# EAGLE design driver (EAGLE 5.02)
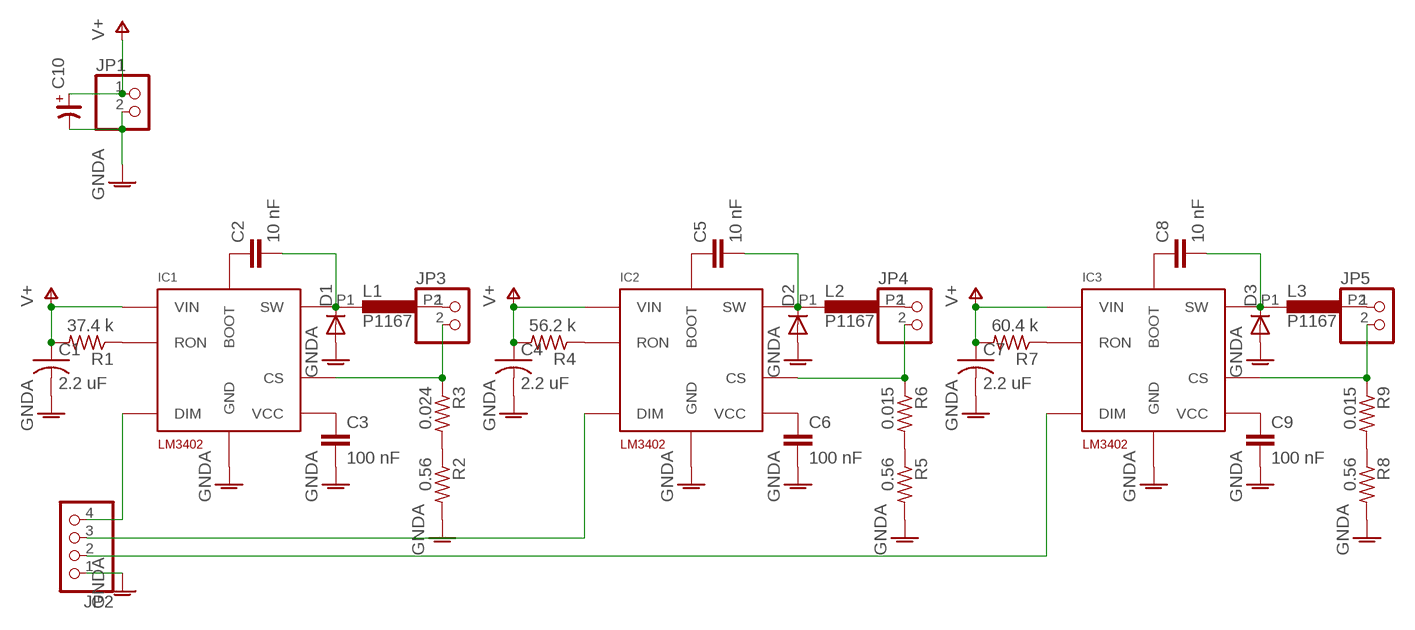
[diagram p0: schematic, sheet 1]

## Parts
C1  2.2 uF  C-USC1206  [C1206]
C2  10 nF  C-EUC0402  [C0402]
C3  100 nF  C-EUC0603  [C0603]
C4  2.2 uF  C-USC1206  [C1206]
C5  10 nF  C-EUC0402  [C0402]
C6  100 nF  C-EUC0603  [C0603]
C7  2.2 uF  C-USC1206  [C1206]
C8  10 nF  C-EUC0402  [C0402]
C9  100 nF  C-EUC0603  [C0603]
C10  CP_SV-D  [CSV-D]
D1  DIODE-SOD123  [SOD123]
D2  DIODE-SOD123  [SOD123]
D3  DIODE-SOD123  [SOD123]
IC1  LM3402  [8-PSOP]
IC2  LM3402  [8-PSOP]
IC3  LM3402  [8-PSOP]
JP1  PINHD-1X2  [1X02]
JP2  PINHD-1X4  [1X04]
JP3  PINHD-1X2  [1X02]
JP4  PINHD-1X2  [1X02]
JP5  PINHD-1X2  [1X02]
L1  P1167  [P1167]
L2  P1167  [P1167]
L3  P1167  [P1167]
R1  37.4 k  R-US_R0805  [R0805]
R2  0.56  R-US_R0805  [R0805]
R3  0.024  R-US_R1206  [R1206]
R4  56.2 k  R-US_R0805  [R0805]
R5  0.56  R-US_R0805  [R0805]
R6  0.015  R-US_R2010  [R2010]
R7  60.4 k  R-US_R0805  [R0805]
R8  0.56  R-US_R0805  [R0805]
R9  0.015  R-US_R2010  [R2010]

## Nets
GNDA: C1.2 C3.2 C4.2 C6.2 C7.2 C9.2 C10.- D1.A D2.A D3.A IC1.P4(GND) IC2.P4(GND) IC3.P4(GND) JP1.2 JP2.1 R2.2 R5.2 R8.2
N$1: C2.1 IC1.P2(BOOT)
N$2: C3.1 IC1.P7(VCC)
N$3: IC1.P3(DIM) JP2.4
N$4: C2.2 D1.C IC1.P1(SW) L1.P1
N$5: IC1.P6(RON) R1.1
N$6: IC1.P5(CS) JP3.2 R3.1
N$7: R2.1 R3.2
N$8: JP3.1 L1.P2
N$9: IC2.P3(DIM) JP2.3
N$10: IC3.P3(DIM) JP2.2
N$11: IC2.P6(RON) R4.1
N$12: R5.1 R6.2
N$13: C5.1 IC2.P2(BOOT)
N$14: C5.2 D2.C IC2.P1(SW) L2.P1
N$15: C6.1 IC2.P7(VCC)
N$16: JP4.1 L2.P2
N$17: IC2.P5(CS) JP4.2 R6.1
N$18: IC3.P6(RON) R7.1
N$19: JP5.1 L3.P2
N$20: C8.1 IC3.P2(BOOT)
N$21: C9.1 IC3.P7(VCC)
N$22: R8.1 R9.2
N$23: C8.2 D3.C IC3.P1(SW) L3.P1
N$25: IC3.P5(CS) JP5.2 R9.1
V+: C1.1 C4.1 C7.1 C10.+ IC1.P8(VIN) IC2.P8(VIN) IC3.P8(VIN) JP1.1 R1.2 R4.2 R7.2

## Library data of the parts
C1 C4 C7 = rcl:C-US: CAPACITOR, American symbol
C2 C3 C5 C6 C8 C9 = rcl:C-EU: CAPACITOR, European symbol
C10 = rc-master-smd:CP_: POLARIZED CAP
D1-D3 = diode:DIODE-: DIODE
IC1-IC3 = indaylight:LM3402
JP1 JP3-JP5 = pinhead:PINHD-1X2: PIN HEADER
JP2 = pinhead:PINHD-1X4: PIN HEADER
L1-L3 = indaylight:P1167
R1-R9 = rcl:R-US_: RESISTOR, American symbol

## Board
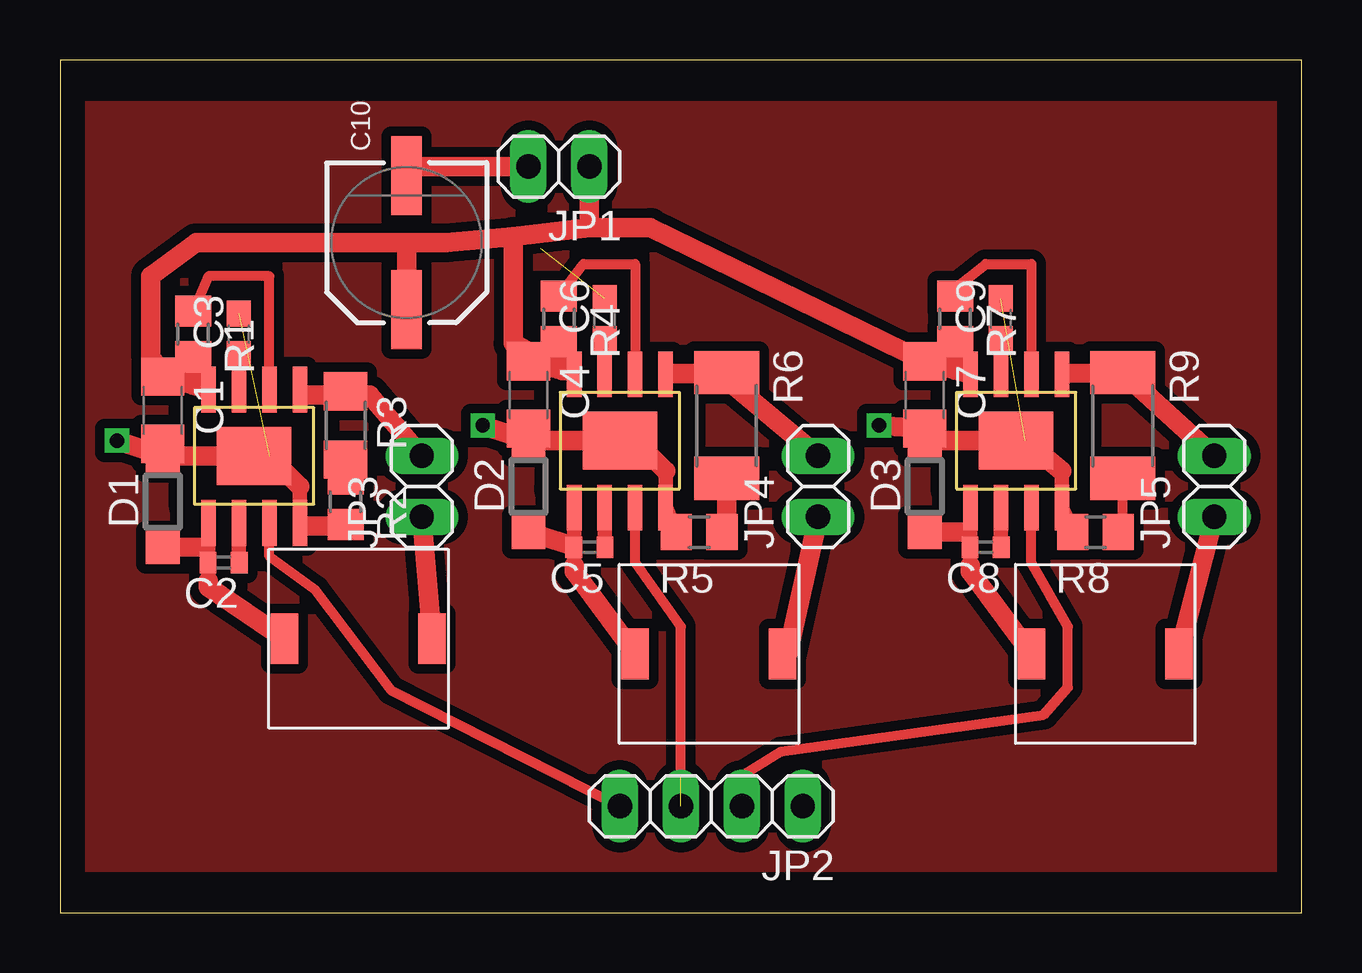
[diagram p1: board, top side]
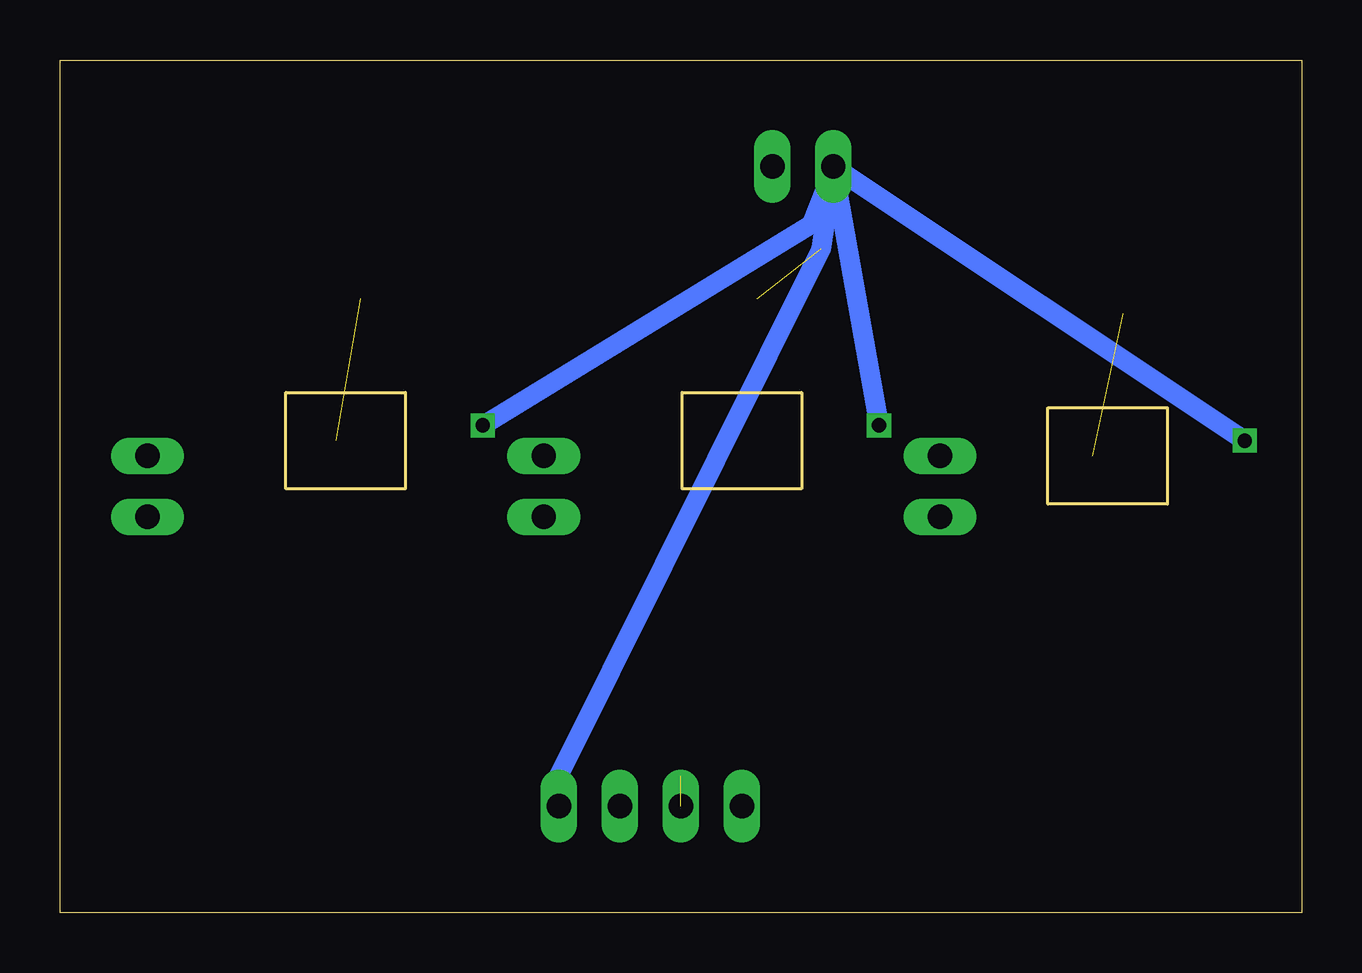
[diagram p2: board, bottom side, seen from below]

Size 51.74 x 35.55 mm. Coordinates in mm from the lower left corner, seen from the top.
Outline: 0,0 51.74,0 51.74,35.55 0,35.55 0,0
Copper layers (1*16): Top 0.035mm / dielectric 1.5mm / Bottom 0.035mm
Design rules "default": minimum track width 10mil, minimum drill 24mil, track to track 8mil, track to pad 8mil, pad to pad 8mil, via to via 8mil, smd to smd 8mil, copper to edge 40mil, drill to drill 8mil, minimum pad ring 10mil, minimum via ring 8mil, stop-mask expansion 4mil, vias tented up to drill 0mil, thermal gap 10mil

### Footprints (pad centres in the part's own frame; a part is rotated, then mirrored left to right if it is on the bottom)
C1206 = smd 1.6 x 1.8: 1 -1.4,0; 2 1.4,0
C0402 = smd 0.7 x 0.9: 1 -0.65,0; 2 0.65,0
C0603 = smd 1.1 x 1: 1 -0.85,0; 2 0.85,0
CSV-D = smd 3.302 x 1.27: + -2.794,0; - 2.794,0
SOD123 = smd 1.4 x 1.4: A 1.9,0; C -1.9,0
8-PSOP = smd 3.099 x 2.413: DAP 0,0 | smd 0.61 x 1.905: P1 -1.905,-2.794; P2 -0.635,-2.794; P3 0.635,-2.794; P4 1.905,-2.794; P5 1.905,2.769; P6 0.635,2.769; P7 -0.635,2.769; P8 -1.905,2.769
1X02 = drill 1.016 long: 1 -1.27,0; 2 1.27,0
1X04 = drill 1.016 long: 1 -3.81,0; 2 -1.27,0; 3 1.27,0; 4 3.81,0
P1167 = smd 1.143 x 2.108: P1 -2.54,0; P2 3.607,0
R0805 = smd 1.3 x 1.5: 1 -0.95,0; 2 0.95,0
R1206 = smd 1.6 x 1.803: 1 -1.422,0; 2 1.422,0
R2010 = smd 1.8 x 2.7: 1 -2.2,0; 2 2.2,0

### Placement (x,y rotation side)
C1  4.28,20.95 270 top
C2  6.82,14.6 180 top
C3  7.46,24.12 90 top
C4  19.52,21.58 270 top
C5  22.06,15.24 180 top
C6  22.7,24.76 90 top
C7  36.03,21.58 270 top
C8  38.57,15.24 180 top
C9  39.2,24.76 90 top
C10  14.44,27.93 90 top
D1  4.28,17.14 90 top
D2  19.52,17.77 90 top
D3  36.03,17.77 90 top
IC1  8.09,19.04 0 top
IC2  23.33,19.68 0 top
IC3  39.84,19.68 0 top
JP1  20.79,31.11 180 top
JP2  27.14,4.44 180 top
JP3  15.08,17.77 90 top
JP4  31.58,17.77 90 top
JP5  48.09,17.77 90 top
L1  11.9,11.43 0 top
L2  26.5,10.79 0 top
L3  43.02,10.79 0 top
R1  5.55,24.12 270 top
R2  11.9,17.14 270 top
R3  11.9,20.31 270 top
R4  20.79,24.76 270 top
R5  26.63,15.87 180 top
R6  27.77,20.31 270 top
R7  37.3,24.76 270 top
R8  43.14,15.87 180 top
R9  44.28,20.31 270 top

### Tracks (layer width: path | path; a pad name or v marks a point on that pad's centre or on a via)
GNDA  (via drill 0.6)  (3 unrouted)
  Top 0.406: C1.2 4.28,19.68 | D1.A | C4.2 D2.A | IC3.P4 41.74,17.14
  Top 0.61: 10,17.77 IC1.P4 10.12,16.12 | 41.74,18.41 IC3.P4 42.25,15.87 R8.2 | R5.2 IC2.P4 25.23,18.41
  Top 0.813: D1.A 8.73,19.04 10,17.77 | C1.2 D1.A v2.38,19.68 | D3.A 40.22,19.68 41.74,18.41 | v34.12,20.31 C7.2 D3.A | D3.A | C10.- 14.44,31.11 JP1.2 | v17.61,20.31 D2.A 23.96,19.68 25.23,18.41 | R2.2 11.9,16.12 10.12,16.12
  Bottom 0.406: 30.95,5.71 JP2.1
  Bottom 0.813: v2.38,19.68 JP1.2 | JP1.2 v17.61,20.31 | v34.12,20.31 20.41,28.7 19.52,30.98 | 30.95,5.71 20.03,27.68 19.52,30.98 | JP1.2 19.52,30.98
N$1
  Top 0.406: C2.1 7.46,14.6
  Top 0.61: 7.46,14.6 IC1.P2
N$2
  Top 0.406: IC1.P7 C3.1
N$3
  Top 0.406: IC1.P3 8.73,14.85 10.63,13.46 13.81,9.27 JP2.4
N$4
  Top 0.61: 6.18,13.84 6.18,14.6 C2.2 6.18,15.24 | IC1.P1 6.18,15.87 6.18,15.24 | 6.06,15.24 6.18,15.24
  Top 0.813: L1.P1 6.18,13.58 6.18,13.84 | D1.C 6.06,15.24
N$5
  Top 0.406: R1.1 6.18,26.54 8.73,26.54 IC1.P6
N$6
  Top 0.406: 11.9,21.58 R3.1
  Top 0.61: IC1.P5 10.1,21.58
  Top 0.813: 10.1,21.58 11.9,21.58 12.92,21.58 JP3.2
N$7
  Top 0.406: 11.9,19.04 R3.2 R2.1
N$8
  Top 0.813: L1.P2 JP3.1
N$9  (1 unrouted)
  Top 0.406: IC2.P3 23.96,14.6 25.87,11.93 25.87,5.71
N$10
  Top 0.406: IC3.P3 40.48,14.6 42,11.93 42,9.39 40.98,8.25 30.06,6.73 28.41,5.71 JP2.2
N$11
  Top 0.406: IC2.P6 23.96,27.05 21.81,27.05 R4.1
N$12
  Top 0.406: R5.1 27.77,15.87
  Top 0.813: 27.77,15.87 R6.2
N$13
  Top 0.406: C5.1 22.7,15.24
  Top 0.61: 22.7,15.24 IC2.P2
N$14
  Top 0.61: C5.2 21.42,14.47 | 21.17,15.36 C5.2 | C5.2 21.42,15.24 IC2.P1
  Top 0.813: L2.P1 21.42,14.22 21.42,14.47 | D2.C 21.17,15.36
N$15
  Top 0.406: C6.1 IC2.P7
N$16
  Top 0.813: L2.P2 30.31,10.79 JP4.1
N$17
  Top 0.406: 27.77,22.47 27.77,22.22
  Top 0.61: IC2.P5 25.36,22.47
  Top 0.813: 27.77,22.22 JP4.2 | R6.1 27.77,22.47 25.36,22.47
N$18
  Top 0.406: IC3.P6 40.48,27.05 38.57,27.05 37.3,26.03 R7.1
N$19
  Top 0.813: L3.P2 JP5.1
N$20
  Top 0.406: C8.1 39.2,15.24
  Top 0.61: 39.2,15.24 IC3.P2
N$21
  Top 0.406: C9.1 IC3.P7
N$22
  Top 0.406: R8.1 44.28,15.87 R9.2
N$23
  Top 0.61: 37.94,15.24 37.94,15.87 | 37.94,15.87 IC3.P1 | 37.94,15.24 C8.2 | 37.94,14.47 37.94,15.24 | 37.94,15.87 37.68,15.87
  Top 0.813: 37.68,15.87 D3.C | L3.P1 37.94,14.22 37.94,14.47
N$24
  pour Top (isolate 0.406): 0.47,33.65 51.27,33.65 51.27,1.9 0.47,1.9
N$25
  Top 0.61: IC3.P5 42,22.47
  Top 0.813: 42,22.47 R9.1 JP5.2
V+
  Top 0.406: R4.2 20.79,23.49 | IC3.P8 37.94,22.22
  Top 0.61: 6.18,21.58 IC1.P8 6.18,21.84 6.06,21.84 | 5.55,23.11 R1.2 | 21.3,22.6 IC2.P8 | 37.81,22.47 IC3.P8
  Top 0.813: 18.88,28.19 18.88,23.75 20.92,22.6 | 14.44,27.93 5.68,27.93 3.77,26.54 3.77,23.24 C1.1 5.52,21.99 | 14.44,27.93 16.09,27.93 18.88,28.19 | 18.88,28.19 22.06,28.57 | 22.06,28.57 24.6,28.57 C7.1 37.27,22.63 | 22.06,28.57 JP1.1 | 14.44,27.93 C10.+ | 20.92,22.6 21.3,22.6 | R4.2 20.66,23.74 20.92,22.6 | 20.92,22.6 C4.1 | 37.27,22.63 37.81,22.47 | 37.27,22.63 37.3,22.73 R7.2 | 5.52,21.99 6.06,21.84 | 5.52,21.99 5.55,22.09 5.55,23.11